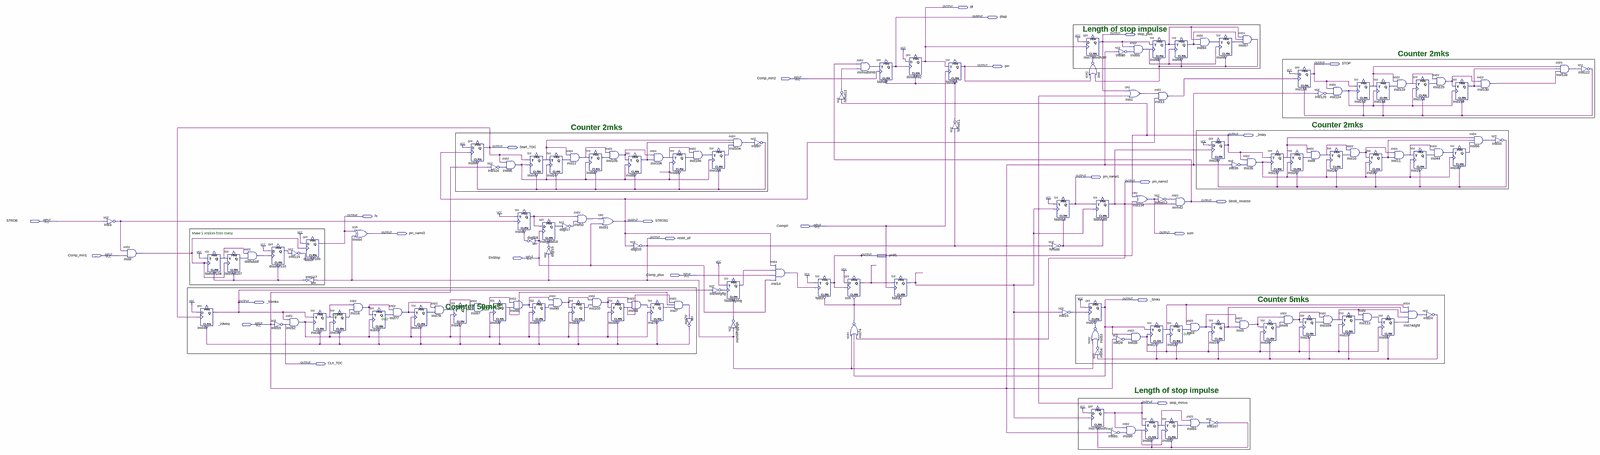
[diagram p0: schematic sheet, whole]
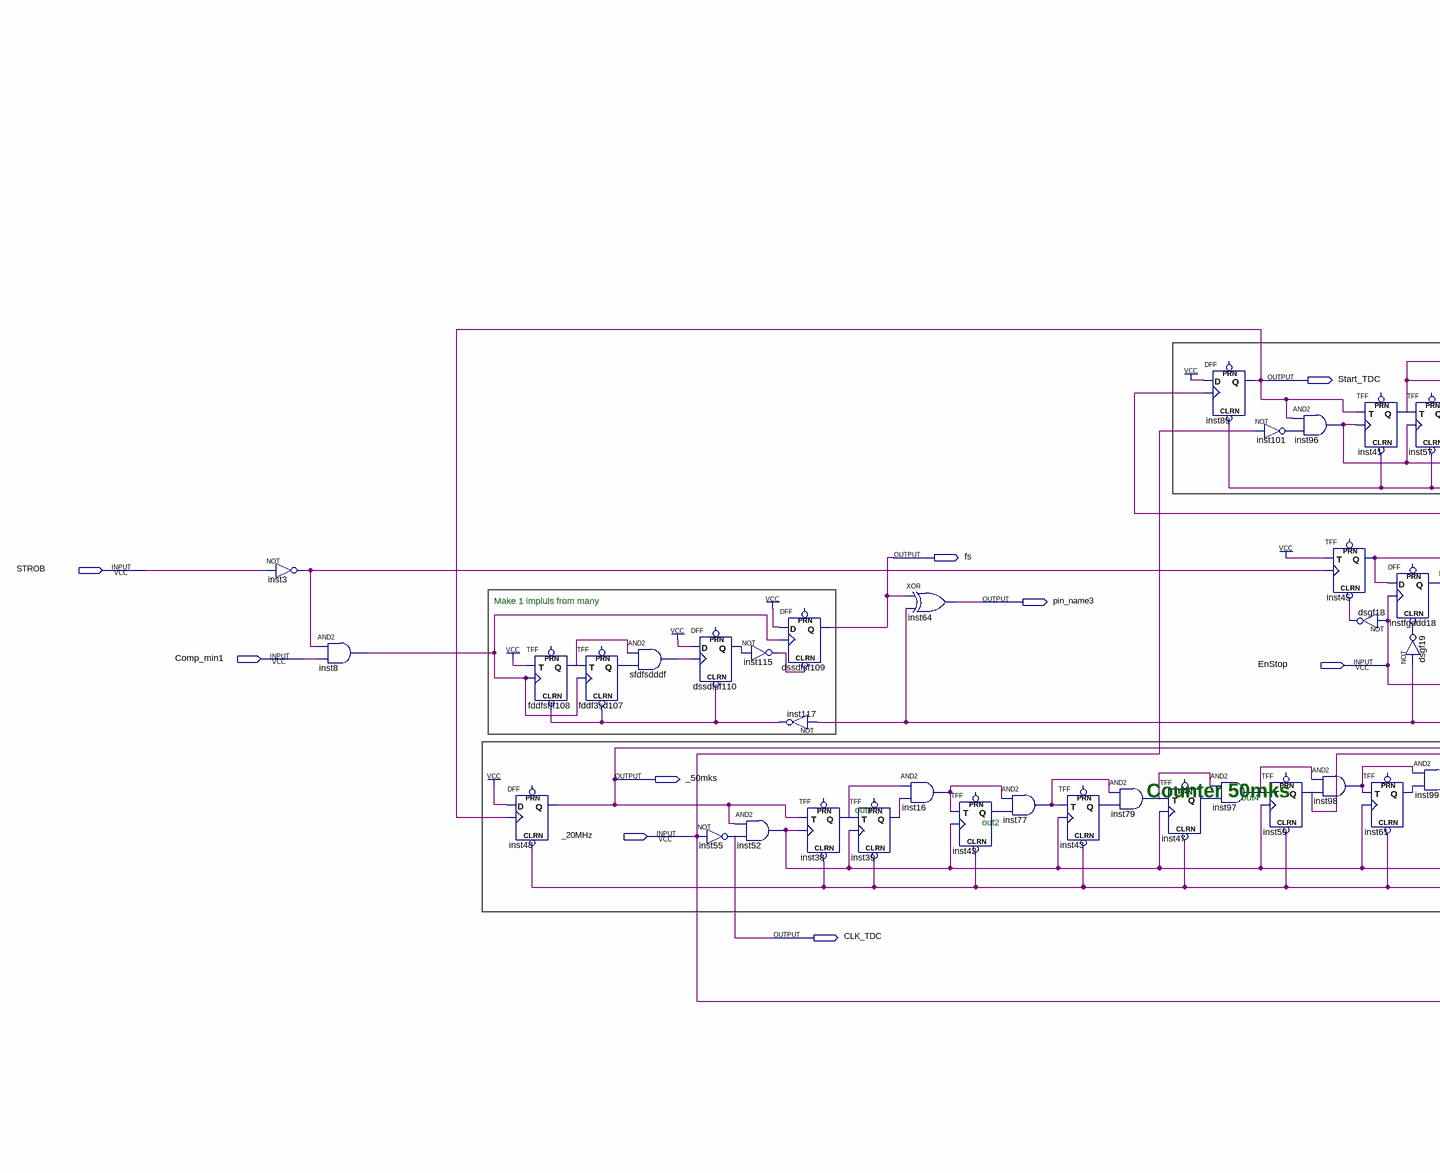
[diagram p1: schematic sheet, left part]
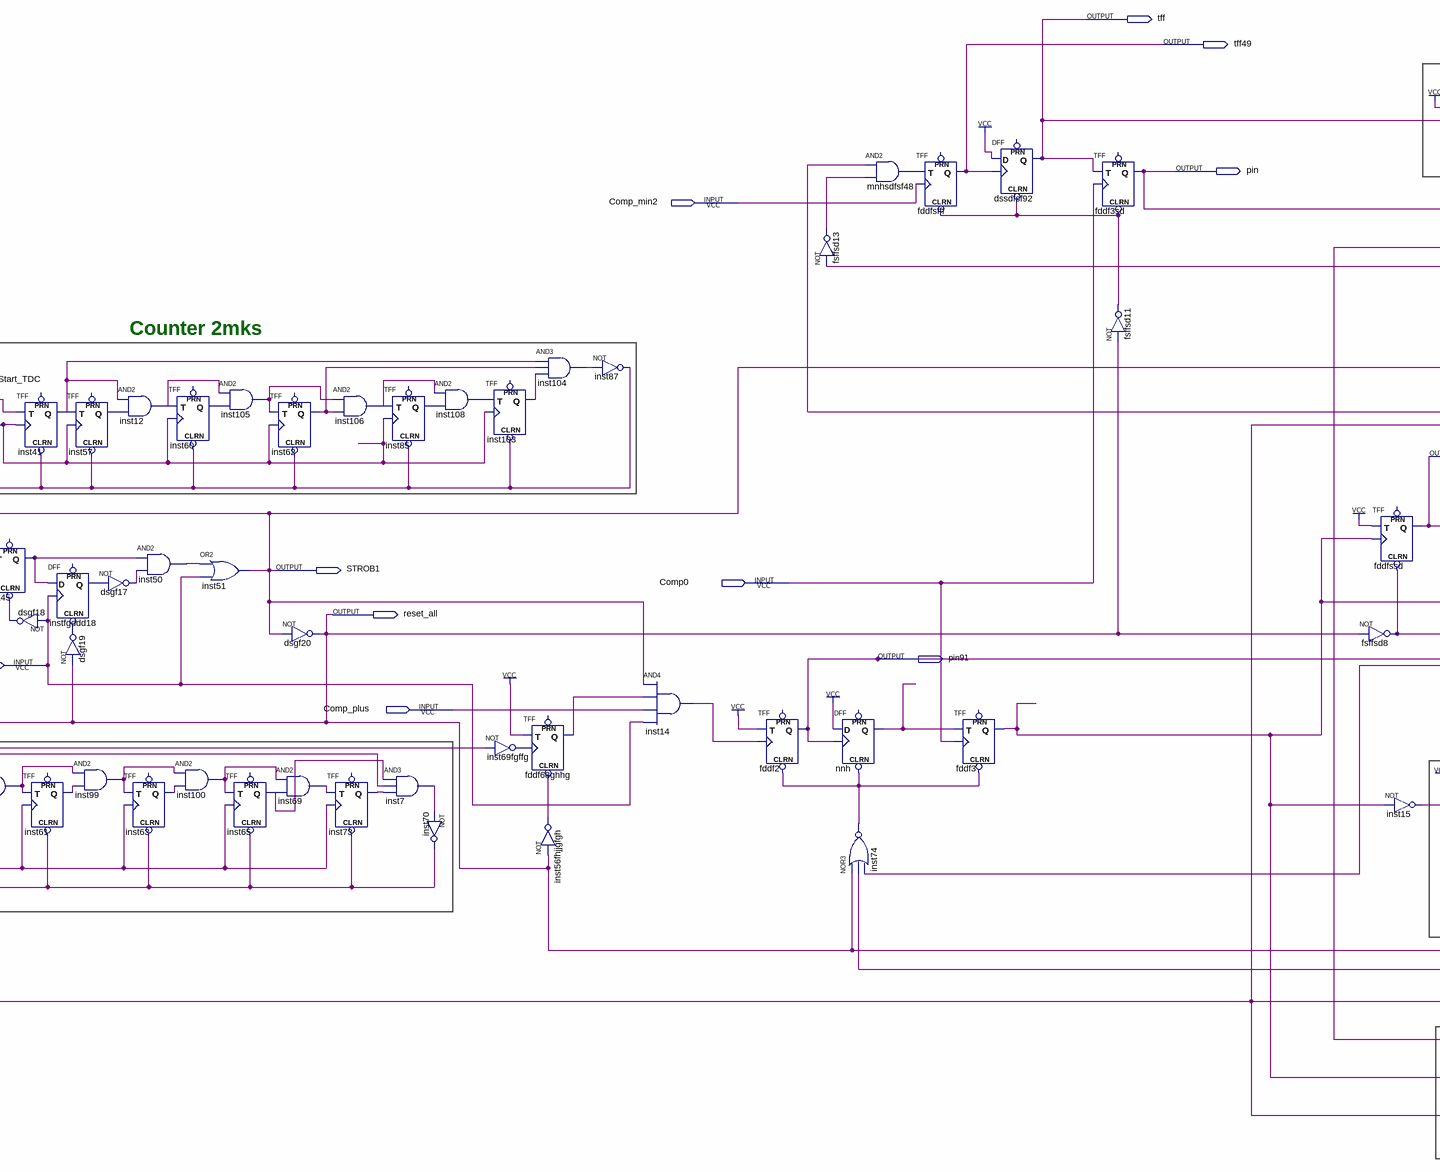
[diagram p2: schematic sheet, centre part]
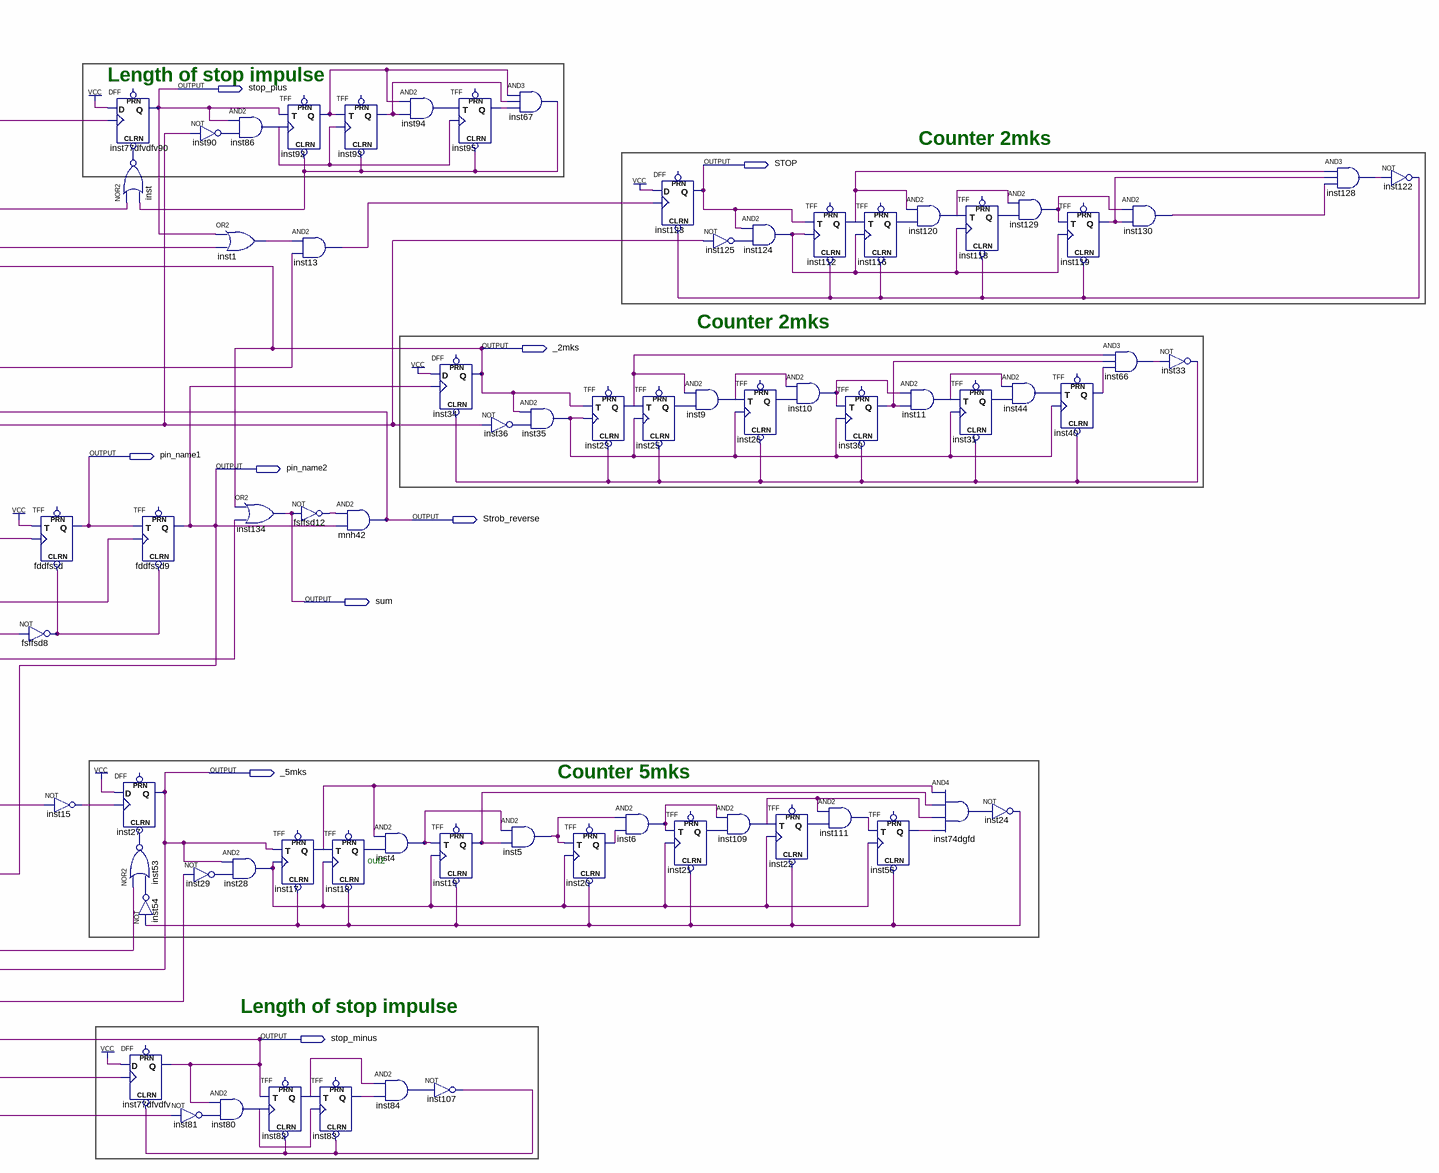
[diagram p3: schematic sheet, right part]
// Quartus schematic sdsdd.bdf as structural Verilog: 141 symbols, 27 pins
module sdsdd (
  input  Comp_min2,
  input  STROB,
  input  Comp0,
  input  Comp_min1,
  input  EnStop,
  input  Comp_plus,
  input  _20MHz,
  output tff,
  output tff49,
  output stop_plus,
  output STOP,
  output pin,
  output _2mks,
  output Start_TDC,
  output pin_name1,
  output pin_name2,
  output Strob_reverse,
  output fs,
  output STROB1,
  output pin_name3,
  output sum,
  output reset_all,
  output pin91,
  output _5mks,
  output _50mks,
  output CLK_TDC,
  output stop_minus
);

  wire dsgf17_out, dsgf18_out, dsgf19_out, dssdfsf110_q, fddf3_q, fddf3sd107_q, fddf68ghhg_q, fddfsfff108_q,
       fsffsd8_out, fsffsd11_out, fsffsd12_out, fsffsd13_out, inst1_out, inst3_out, inst4_out, inst5_out,
       inst6_out, inst7_out, inst8_out, inst9_out, inst10_out, inst11_out, inst12_out, inst13_out,
       inst14_out, inst15_out, inst16_out, inst17_q, inst18_q, inst19_q, inst20_q, inst21_q, inst22_q,
       inst23_q, inst24_out, inst25_q, inst26_q, inst28_out, inst29_out, inst30_q, inst31_q, inst33_out,
       inst35_out, inst36_out, inst38_q, inst39_q, inst40_q, inst41_q, inst42_q, inst43_q, inst44_out,
       inst45_q, inst47_q, inst50_out, inst52_out, inst53_out, inst54_out, inst56_q, inst56fhjjgfgh_out,
       inst57_q, inst59_q, inst60_q, inst61_q, inst62_q, inst63_q, inst65_q, inst66_out, inst67_out,
       inst69_out, inst69fgffg_out, inst70_out, inst73_q, inst74_out, inst74dgfd_out, inst77_out, inst79_out,
       inst80_out, inst81_out, inst82_q, inst83_q, inst84_out, inst85_q, inst86_out, inst87_out, inst90_out,
       inst92_q, inst93_q, inst94_out, inst95_q, inst96_out, inst97_out, inst98_out, inst99_out, inst100_out,
       inst101_out, inst103_q, inst104_out, inst105_out, inst106_out, inst107_out, inst108_out, inst109_out,
       inst111_out, inst112_q, inst115_out, inst116_q, inst117_out, inst118_q, inst119_q, inst120_out,
       inst122_out, inst124_out, inst125_out, inst128_out, inst129_out, inst130_out, inst_out, instfgddd18_q,
       mnhsdfsf48_out, nnh_q, sfdfsdddf_out;

  not inst3 (inst3_out, STROB);
  and inst8 (inst8_out, inst3_out, Comp_min1);
  TFF fddfsfff108 (.CLRN(inst117_out), .T(1'b1), .CLK(inst8_out), .Q(fddfsfff108_q));  // open: PRN
  DFF inst48 (.CLRN(inst70_out), .CLK(Start_TDC), .D(1'b1), .Q(_50mks));  // open: PRN
  TFF fddf3sd107 (.CLRN(inst117_out), .T(fddfsfff108_q), .CLK(inst8_out), .Q(fddf3sd107_q));  // open: PRN
  and sfdfsdddf (sfdfsdddf_out, fddfsfff108_q, fddf3sd107_q);
  DFF dssdfsf110 (.CLRN(inst117_out), .CLK(sfdfsdddf_out), .D(1'b1), .Q(dssdfsf110_q));  // open: PRN
  not inst115 (inst115_out, dssdfsf110_q);
  and inst52 (inst52_out, _50mks, CLK_TDC);
  not inst55 (CLK_TDC, _20MHz);
  DFF dssdfsf109 (.CLRN(inst115_out), .CLK(inst8_out), .D(1'b1), .Q(fs));  // open: PRN
  not inst117 (inst117_out, reset_all);
  TFF inst38 (.CLRN(inst70_out), .T(_50mks), .CLK(inst52_out), .Q(inst38_q));  // open: PRN
  TFF inst39 (.CLRN(inst70_out), .T(inst38_q), .CLK(inst52_out), .Q(inst39_q));  // open: PRN
  xor inst64 (pin_name3, fs, reset_all);
  and inst16 (inst16_out, inst38_q, inst39_q);
  TFF inst42 (.CLRN(inst70_out), .T(inst16_out), .CLK(inst52_out), .Q(inst42_q));  // open: PRN
  and inst77 (inst77_out, inst16_out, inst42_q);
  TFF inst43 (.CLRN(inst70_out), .T(inst77_out), .CLK(inst52_out), .Q(inst43_q));  // open: PRN
  and inst79 (inst79_out, inst77_out, inst43_q);
  TFF inst47 (.CLRN(inst70_out), .T(inst79_out), .CLK(inst52_out), .Q(inst47_q));  // open: PRN
  DFF inst89 (.CLRN(inst87_out), .CLK(STROB1), .D(1'b1), .Q(Start_TDC));  // open: PRN
  and inst97 (inst97_out, inst79_out, inst47_q);
  and inst96 (inst96_out, Start_TDC, inst101_out);
  not inst101 (inst101_out, _20MHz);
  TFF inst59 (.CLRN(inst70_out), .T(inst97_out), .CLK(inst52_out), .Q(inst59_q));  // open: PRN
  TFF inst45 (.CLRN(dsgf18_out), .T(1'b1), .CLK(inst3_out), .Q(inst45_q));  // open: PRN
  not dsgf18 (dsgf18_out, EnStop);
  and inst98 (inst98_out, inst97_out, inst59_q);
  TFF inst41 (.CLRN(inst87_out), .T(Start_TDC), .CLK(inst96_out), .Q(inst41_q));  // open: PRN
  DFF instfgddd18 (.CLRN(dsgf19_out), .CLK(EnStop), .D(inst45_q), .Q(instfgddd18_q));  // open: PRN
  not dsgf19 (dsgf19_out, reset_all);
  TFF inst61 (.CLRN(inst70_out), .T(inst98_out), .CLK(inst52_out), .Q(inst61_q));  // open: PRN
  TFF inst57 (.CLRN(inst87_out), .T(inst41_q), .CLK(inst96_out), .Q(inst57_q));  // open: PRN
  not dsgf17 (dsgf17_out, instfgddd18_q);
  and inst99 (inst99_out, inst98_out, inst61_q);
  and inst12 (inst12_out, inst41_q, inst57_q);
  and inst50 (inst50_out, inst45_q, dsgf17_out);
  TFF inst63 (.CLRN(inst70_out), .T(inst99_out), .CLK(inst52_out), .Q(inst63_q));  // open: PRN
  TFF inst60 (.CLRN(inst87_out), .T(inst12_out), .CLK(inst96_out), .Q(inst60_q));  // open: PRN
  or inst51 (STROB1, inst50_out, EnStop);
  and inst100 (inst100_out, inst99_out, inst63_q);
  and inst105 (inst105_out, inst12_out, inst60_q);
  TFF inst65 (.CLRN(inst70_out), .T(inst100_out), .CLK(inst52_out), .Q(inst65_q));  // open: PRN
  TFF inst62 (.CLRN(inst87_out), .T(inst105_out), .CLK(inst96_out), .Q(inst62_q));  // open: PRN
  not dsgf20 (reset_all, STROB1);
  and inst69 (inst69_out, inst100_out, inst65_q);
  and inst106 (inst106_out, inst105_out, inst62_q);
  TFF inst73 (.CLRN(inst70_out), .T(inst69_out), .CLK(inst52_out), .Q(inst73_q));  // open: PRN
  TFF inst85 (.CLRN(inst87_out), .T(inst106_out), .CLK(inst96_out), .Q(inst85_q));  // open: PRN
  and inst7 (inst7_out, inst65_q, inst59_q, inst73_q);
  and inst108 (inst108_out, inst106_out, inst85_q);
  not inst70 (inst70_out, inst7_out);
  TFF inst103 (.CLRN(inst87_out), .T(inst108_out), .CLK(inst96_out), .Q(inst103_q));  // open: PRN
  not inst69fgffg (inst69fgffg_out, _50mks);
  and inst104 (inst104_out, inst41_q, inst62_q, inst103_q);
  TFF fddf68ghhg (.CLRN(inst56fhjjgfgh_out), .T(1'b1), .CLK(inst69fgffg_out), .Q(fddf68ghhg_q));  // open: PRN
  not inst56fhjjgfgh (inst56fhjjgfgh_out, reset_all);
  not inst87 (inst87_out, inst104_out);
  and inst14 (inst14_out, STROB1, fddf68ghhg_q, Comp_plus, EnStop);
  TFF fddf2 (.CLRN(inst74_out), .T(1'b1), .CLK(inst14_out), .Q(pin91));  // open: PRN
  not fsffsd13 (fsffsd13_out, _2mks);
  and mnhsdfsf48 (mnhsdfsf48_out, Strob_reverse, fsffsd13_out);
  DFF nnh (.CLRN(inst74_out), .CLK(pin91), .D(1'b1), .Q(nnh_q));  // open: PRN
  nor inst74 (inst74_out, reset_all, _5mks, pin_name2);
  TFF fddfsfff (.CLRN(fsffsd11_out), .T(mnhsdfsf48_out), .CLK(Comp_min2), .Q(tff49));  // open: PRN
  TFF fddf3 (.CLRN(inst74_out), .T(nnh_q), .CLK(Comp0), .Q(fddf3_q));  // open: PRN
  DFF dssdfsf92 (.CLRN(fsffsd11_out), .CLK(tff49), .D(1'b1), .Q(tff));  // open: PRN
  TFF fddf3sd (.CLRN(fsffsd11_out), .T(tff), .CLK(Comp0), .Q(pin));  // open: PRN
  not fsffsd11 (fsffsd11_out, reset_all);
  TFF fddfssd (.CLRN(fsffsd8_out), .T(1'b1), .CLK(fddf3_q), .Q(pin_name1));  // open: PRN
  not fsffsd8 (fsffsd8_out, reset_all);
  not inst15 (inst15_out, fddf3_q);
  DFF inst77dfvdfv90 (.CLRN(inst_out), .CLK(tff), .D(1'b1), .Q(stop_plus));  // open: PRN
  nor inst (inst_out, pin, inst67_out);
  TFF fddfssd9 (.CLRN(fsffsd8_out), .T(pin_name1), .CLK(fddf3_q), .Q(pin_name2));  // open: PRN
  DFF inst27 (.CLRN(inst53_out), .CLK(inst15_out), .D(1'b1), .Q(_5mks));  // open: PRN
  nor inst53 (inst53_out, reset_all, inst54_out);
  not inst54 (inst54_out, inst24_out);
  DFF inst77dfvdfv (.CLRN(inst107_out), .CLK(fddf3_q), .D(1'b1), .Q(stop_minus));  // open: PRN
  not inst90 (inst90_out, _20MHz);
  not inst29 (inst29_out, _20MHz);
  not inst81 (inst81_out, _20MHz);
  and inst86 (inst86_out, stop_plus, inst90_out);
  or inst1 (inst1_out, stop_plus, stop_minus);
  or inst134 (sum, _2mks, pin91);
  and inst28 (inst28_out, _5mks, inst29_out);
  and inst80 (inst80_out, stop_minus, inst81_out);
  TFF inst92 (.CLRN(inst67_out), .T(stop_plus), .CLK(inst86_out), .Q(inst92_q));  // open: PRN
  and inst13 (inst13_out, inst1_out, STROB1);
  not fsffsd12 (fsffsd12_out, sum);
  TFF inst17 (.CLRN(inst24_out), .T(_5mks), .CLK(inst28_out), .Q(inst17_q));  // open: PRN
  TFF inst82 (.CLRN(inst107_out), .T(stop_minus), .CLK(inst80_out), .Q(inst82_q));  // open: PRN
  TFF inst93 (.CLRN(inst67_out), .T(inst92_q), .CLK(inst86_out), .Q(inst93_q));  // open: PRN
  and mnh42 (Strob_reverse, fsffsd12_out, pin_name2);
  TFF inst18 (.CLRN(inst24_out), .T(inst17_q), .CLK(inst28_out), .Q(inst18_q));  // open: PRN
  TFF inst83 (.CLRN(inst107_out), .T(inst82_q), .CLK(inst80_out), .Q(inst83_q));  // open: PRN
  and inst4 (inst4_out, inst17_q, inst18_q);
  and inst84 (inst84_out, inst82_q, inst83_q);
  and inst94 (inst94_out, inst92_q, inst93_q);
  DFF inst34 (.CLRN(inst33_out), .CLK(pin_name2), .D(1'b1), .Q(_2mks));  // open: PRN
  TFF inst19 (.CLRN(inst24_out), .T(inst4_out), .CLK(inst28_out), .Q(inst19_q));  // open: PRN
  not inst107 (inst107_out, inst84_out);
  TFF inst95 (.CLRN(inst67_out), .T(inst94_out), .CLK(inst86_out), .Q(inst95_q));  // open: PRN
  not inst36 (inst36_out, _20MHz);
  and inst67 (inst67_out, inst92_q, inst93_q, inst95_q);
  and inst35 (inst35_out, _2mks, inst36_out);
  and inst5 (inst5_out, inst4_out, inst19_q);
  TFF inst23 (.CLRN(inst33_out), .T(_2mks), .CLK(inst35_out), .Q(inst23_q));  // open: PRN
  TFF inst20 (.CLRN(inst24_out), .T(inst5_out), .CLK(inst28_out), .Q(inst20_q));  // open: PRN
  TFF inst25 (.CLRN(inst33_out), .T(inst23_q), .CLK(inst35_out), .Q(inst25_q));  // open: PRN
  and inst6 (inst6_out, inst5_out, inst20_q);
  DFF inst123 (.CLRN(inst122_out), .CLK(inst13_out), .D(1'b1), .Q(STOP));  // open: PRN
  and inst9 (inst9_out, inst23_q, inst25_q);
  TFF inst21 (.CLRN(inst24_out), .T(inst6_out), .CLK(inst28_out), .Q(inst21_q));  // open: PRN
  and inst124 (inst124_out, STOP, inst125_out);
  not inst125 (inst125_out, _20MHz);
  TFF inst26 (.CLRN(inst33_out), .T(inst9_out), .CLK(inst35_out), .Q(inst26_q));  // open: PRN
  and inst109 (inst109_out, inst6_out, inst21_q);
  and inst10 (inst10_out, inst9_out, inst26_q);
  TFF inst22 (.CLRN(inst24_out), .T(inst109_out), .CLK(inst28_out), .Q(inst22_q));  // open: PRN
  TFF inst112 (.CLRN(inst122_out), .T(STOP), .CLK(inst124_out), .Q(inst112_q));  // open: PRN
  TFF inst30 (.CLRN(inst33_out), .T(inst10_out), .CLK(inst35_out), .Q(inst30_q));  // open: PRN
  and inst111 (inst111_out, inst109_out, inst22_q);
  TFF inst116 (.CLRN(inst122_out), .T(inst112_q), .CLK(inst124_out), .Q(inst116_q));  // open: PRN
  and inst11 (inst11_out, inst10_out, inst30_q);
  TFF inst56 (.CLRN(inst24_out), .T(inst111_out), .CLK(inst28_out), .Q(inst56_q));  // open: PRN
  and inst120 (inst120_out, inst112_q, inst116_q);
  TFF inst31 (.CLRN(inst33_out), .T(inst11_out), .CLK(inst35_out), .Q(inst31_q));  // open: PRN
  and inst74dgfd (inst74dgfd_out, inst17_q, inst19_q, inst109_out, inst56_q);
  TFF inst118 (.CLRN(inst122_out), .T(inst120_out), .CLK(inst124_out), .Q(inst118_q));  // open: PRN
  and inst44 (inst44_out, inst11_out, inst31_q);
  not inst24 (inst24_out, inst74dgfd_out);
  and inst129 (inst129_out, inst120_out, inst118_q);
  TFF inst40 (.CLRN(inst33_out), .T(inst44_out), .CLK(inst35_out), .Q(inst40_q));  // open: PRN
  TFF inst119 (.CLRN(inst122_out), .T(inst129_out), .CLK(inst124_out), .Q(inst119_q));  // open: PRN
  and inst66 (inst66_out, inst23_q, inst30_q, inst40_q);
  and inst130 (inst130_out, inst129_out, inst119_q);
  not inst33 (inst33_out, inst66_out);
  and inst128 (inst128_out, inst112_q, inst119_q, inst130_out);
  not inst122 (inst122_out, inst128_out);

  // Notes on the sheet:
  //   Length of stop impulse
  //   Counter 2mks
  //   Counter 2mks
  //   Counter 2mks
  //   Make 1 impluls from many
  //   Counter 5mks
  //   Counter 50mks
  //   out4
  //   out1
  //   out2
  //   out2
  //   Length of stop impulse
endmodule
